# Altium schematic sheet pqxSheet01 - 副本.SchDoc: 电路设计与实践课程作业——潘全星（13209110344）
size A4; Author: 潘全星; Revision: v1.0; SheetNumber: 01; SheetTotal: 作业; Rule: PcbType=ProtelPcb; Rule: PcbType=ProtelPcb; Rule: UNIONINDEX{}0[]RULEKIND{}Clearance[]NETSCOPE{}DifferentNets[]LAYERKIND{}SameLayer[]NAME{}Schematic Clearance Constraint[]GAP{}77063.1872mil[]UNIT{}Imperial[]PcbType{}ProtelPcb; Rule: PcbType=ProtelPcb; Rule: PcbType=ProtelPcb
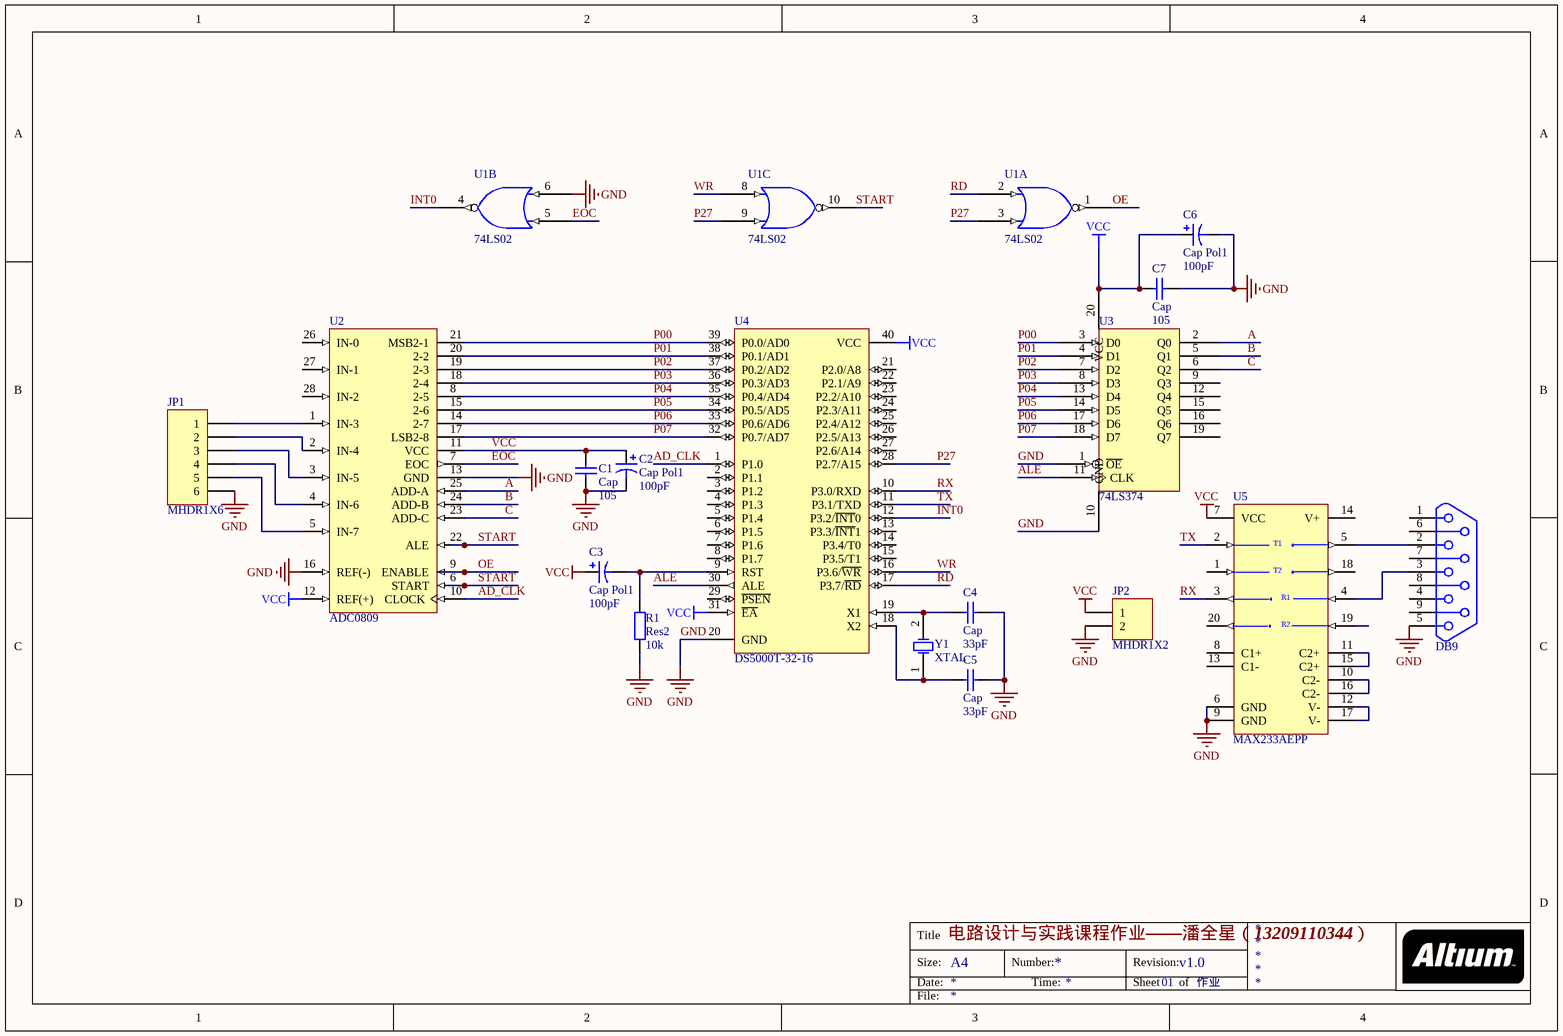
[diagram p0: pqxSheet01 - 副本.SchDoc]

## Parts
?  DB9  [DB9U]
C1  Cap  value 105  [CB1]
C2  Cap Pol1  value 100pF  [CD2.5-5.0]
C3  Cap Pol1  value 100pF  [CD2.5-5.0]
C4  Cap  value 33pF  [CB1]
C5  Cap  value 33pF  [CB1]
C6  Cap Pol1  value 100pF  [CD2.5-5.0]
C7  Cap  value 105  [CB1]
JP1  MHDR1X6  [MHDR1X6]
JP2  MHDR1X2  [MHDR1X2]
R1  Res2  value 10k  [AXIAL-0.4]
U1  74LS02  [DIP14]  (parts A,B,C of 4)
U2  ADC0809  [DIP28-WIDE]
U3  74LS374  [DIP20]
U4  DS5000T-32-16  [UDIP40]
U5  MAX233AEPP  [PP20]
Y1  XTAL  [JZ]

## Nets
GND: ?.5 C1.1 C2.2 C4.1 C5.1 C6.2 C7.1 JP1.6 JP2.2 R1.1 U1.6 U1.7(GND) U2.13(GND) U2.16(REF(-)) U3.1(~{OE}) U3.10(GND) U4.20(GND) U5.6(GND) U5.9(GND)
VCC: C1.2 C2.1 C3.1 C6.1 C7.2 JP2.1 U1.14(VCC) U2.11(VCC) U2.12(REF(+)) U3.20(VCC) U4.31(~{EA}) U4.40(VCC) U5.7(VCC)
A: U2.25(ADD-A) U3.2(Q0)
AD_CLK: U2.10(CLOCK) U4.1(P1.0)
ALE: U3.11(CLK) U4.30(ALE)
B: U2.24(ADD-B) U3.5(Q1)
C: U2.23(ADD-C) U3.6(Q2)
EOC: U1.5 U2.7(EOC)
INT0: U1.4 U4.12(P3.2/~{INT}0)
OE: U1.1 U2.9(ENABLE)
P00: U2.21(MSB2-1) U3.3(D0) U4.39(P0.0/AD0)
P01: U2.20(2-2) U3.4(D1) U4.38(P0.1/AD1)
P02: U2.19(2-3) U3.7(D2) U4.37(P0.2/AD2)
P03: U2.18(2-4) U3.8(D3) U4.36(P0.3/AD3)
P04: U2.8(2-5) U3.13(D4) U4.35(P0.4/AD4)
P05: U2.15(2-6) U3.14(D5) U4.34(P0.5/AD5)
P06: U2.14(2-7) U3.17(D6) U4.33(P0.6/AD6)
P07: U2.17(LSB2-8) U3.18(D7) U4.32(P0.7/AD7)
P27: U1.3 U1.9 U4.28(P2.7/A15)
RD: U1.2 U4.17(P3.7/~{RD})
RX: U4.10(P3.0/RXD) U5.3(R1OUT)
START: U1.10 U2.6(START) U2.22(ALE)
TX: U4.11(P3.1/TXD) U5.2(T1IN)
WR: U1.8 U4.16(P3.6/~{WR})
Net?_2: ?.2 U5.5(T1OUT)
Net?_3: ?.3 U5.4(R1IN)
NetC3_2: C3.2 R1.2 U4.9(RST)
NetC4_2: C4.2 U4.19(X1) Y1.2(OSC2)
NetC5_2: C5.2 U4.18(X2) Y1.1(OSC1)
NetJP1_1: JP1.1 U2.1(IN-3)
NetJP1_2: JP1.2 U2.2(IN-4)
NetJP1_3: JP1.3 U2.3(IN-5)
NetJP1_4: JP1.4 U2.4(IN-6)
NetJP1_5: JP1.5 U2.5(IN-7)
NetU5_10: U5.10(C2-) U5.16(C2-)
NetU5_11: U5.11(C2+) U5.15(C2+)
NetU5_12: U5.12(V-) U5.17(V-)

Not connected (* = marked no-connect by the designer): ? 1 4 6 7 8 9; U2 26(IN-0) 27(IN-1) 28(IN-2); U3 9(Q3) 12(Q4) 15(Q5) 16(Q6) 19(Q7); U4 2(P1.1) 3(P1.2) 4(P1.3) 5(P1.4) 6(P1.5) 7(P1.6) 8(P1.7) 13(P3.3/~{INT}1) 14(P3.4/T0) 15(P3.5/T1) 21(P2.0/A8) 22(P2.1/A9) 23(P2.2/A10) 24(P2.3/A11) 25(P2.4/A12) 26(P2.5/A13) 27(P2.6/A14) 29(~{PSEN}); U5 1(T2IN) 8(C1+) 13(C1-) 14(V+) 18(T2OUT) 19(R2IN) 20(R2OUT)

## Notes on the sheet
- Title
- Size:
- Date:
- A4
- Number:
- Time:
- Revision:
- Sheet
- of
- File:
- (in symbol MAX233AEPP) T1; T2; R1; R2

## Library data of the parts
C1 C4 C5 C7 = Cap: Capacitor; Published: 8-Jun-2000; LatestRevisionDate: 17-Jul-2002; LatestRevisionNote: Re-released for DXP Platform.; PackageReference: RAD-0.3; Publisher: Altium Limited; PackageDescription: Radial Cap, Thru-Hole; 2 Leads; 0.3 in Pin Spacing
C2 C3 C6 = Cap Pol1: Polarized Capacitor (Radial); Published: 8-Jun-2000; LatestRevisionDate: 17-Jul-2002; LatestRevisionNote: Re-released for DXP Platform.; PackageReference: RB7.6-15; Publisher: Altium Limited; PackageDescription: Polarized Capacitor (Radial); 2 Leads
JP1 = MHDR1X6: Header, 6-Pin; LatestRevisionDate: 17-Jul-2002; LatestRevisionNote: Re-released for DXP Platform.; Publisher: Altium Limited
JP2 = MHDR1X2: Header, 2-Pin; LatestRevisionDate: 17-Jul-2002; LatestRevisionNote: Re-released for DXP Platform.; Publisher: Altium Limited
R1 = Res2: Resistor; Published: 8-Jun-2000; LatestRevisionDate: 17-Jul-2002; LatestRevisionNote: Re-released for DXP Platform.; PackageReference: AXIAL-0.4; Publisher: Altium Limited; PackageDescription: Axial Device, Thru-Hole; 2 Leads; 0.4 in Pin Spacing
U4 = DS5000T-32-16: Soft Microcontroller; Published: 13-Oct-2000; LatestRevisionDate: 17-Jul-2002; LatestRevisionNote: PCB footprint, 'DIP-P40/X1.1' replaced; Re-released for DXP Platform.; DatasheetVersion: 21-Apr-1993; PackageReference: ENDIP40A; Publisher: Altium Limited; PackageDescription: DIP; 40 Rectangular Pins; Row Space 15.24 mm; Pitch 2.54 mm; ComponentLink1Description: Manufacturer Link; ComponentLink1URL: http://www.maxim-ic.com/; ComponentLink2Description: Datasheet; ComponentLink2URL: http://pdfserv.maxim-ic.com/en/ds/DS5000T.pdf; ComponentLink3Description: Discontinuation Notice; ComponentLink3URL: http://www.maxim-ic.com/qa/pdfs/non-obsolescence-letter.pdf
U5 = MAX233AEPP: +5V-Powered, Multichannel RS-232 Driver/Receiver; Published: 16-Jan-2001; LatestRevisionDate: 06-Jun-2005; LatestRevisionNote: Stylized 3D Model Added.; DatasheetVersion: Nov-1997; PackageVersion: RevB, 21-0043; PackageReference: PP20; Publisher: Altium Limited; PackageDescription: DIP; 20 Leads; Row Spacing 7.62 mm; Pitch 2.54 mm; Code_JEDEC: MS-001-AE; ComponentLink1Description: Manufacturer Link; ComponentLink1URL: http://www.maxim-ic.com/; ComponentLink2Description: Datasheet; ComponentLink2URL: http://pdfserv.maxim-ic.com/en/ds/MAX220-MAX249.pdf
Y1 = XTAL: Crystal Oscillator; Published: 8-Jun-2000; LatestRevisionDate: 17-Jul-2002; LatestRevisionNote: Re-released for DXP Platform.; PackageReference: R38; Publisher: Altium Limited; PackageDescription: Crystal, Thru-Hole; 2 Leads; Body 3.1 x 8.2 mm (Dia.xH)